# EAGLE design BodyCamBoardV2 (EAGLE 7.3.0)
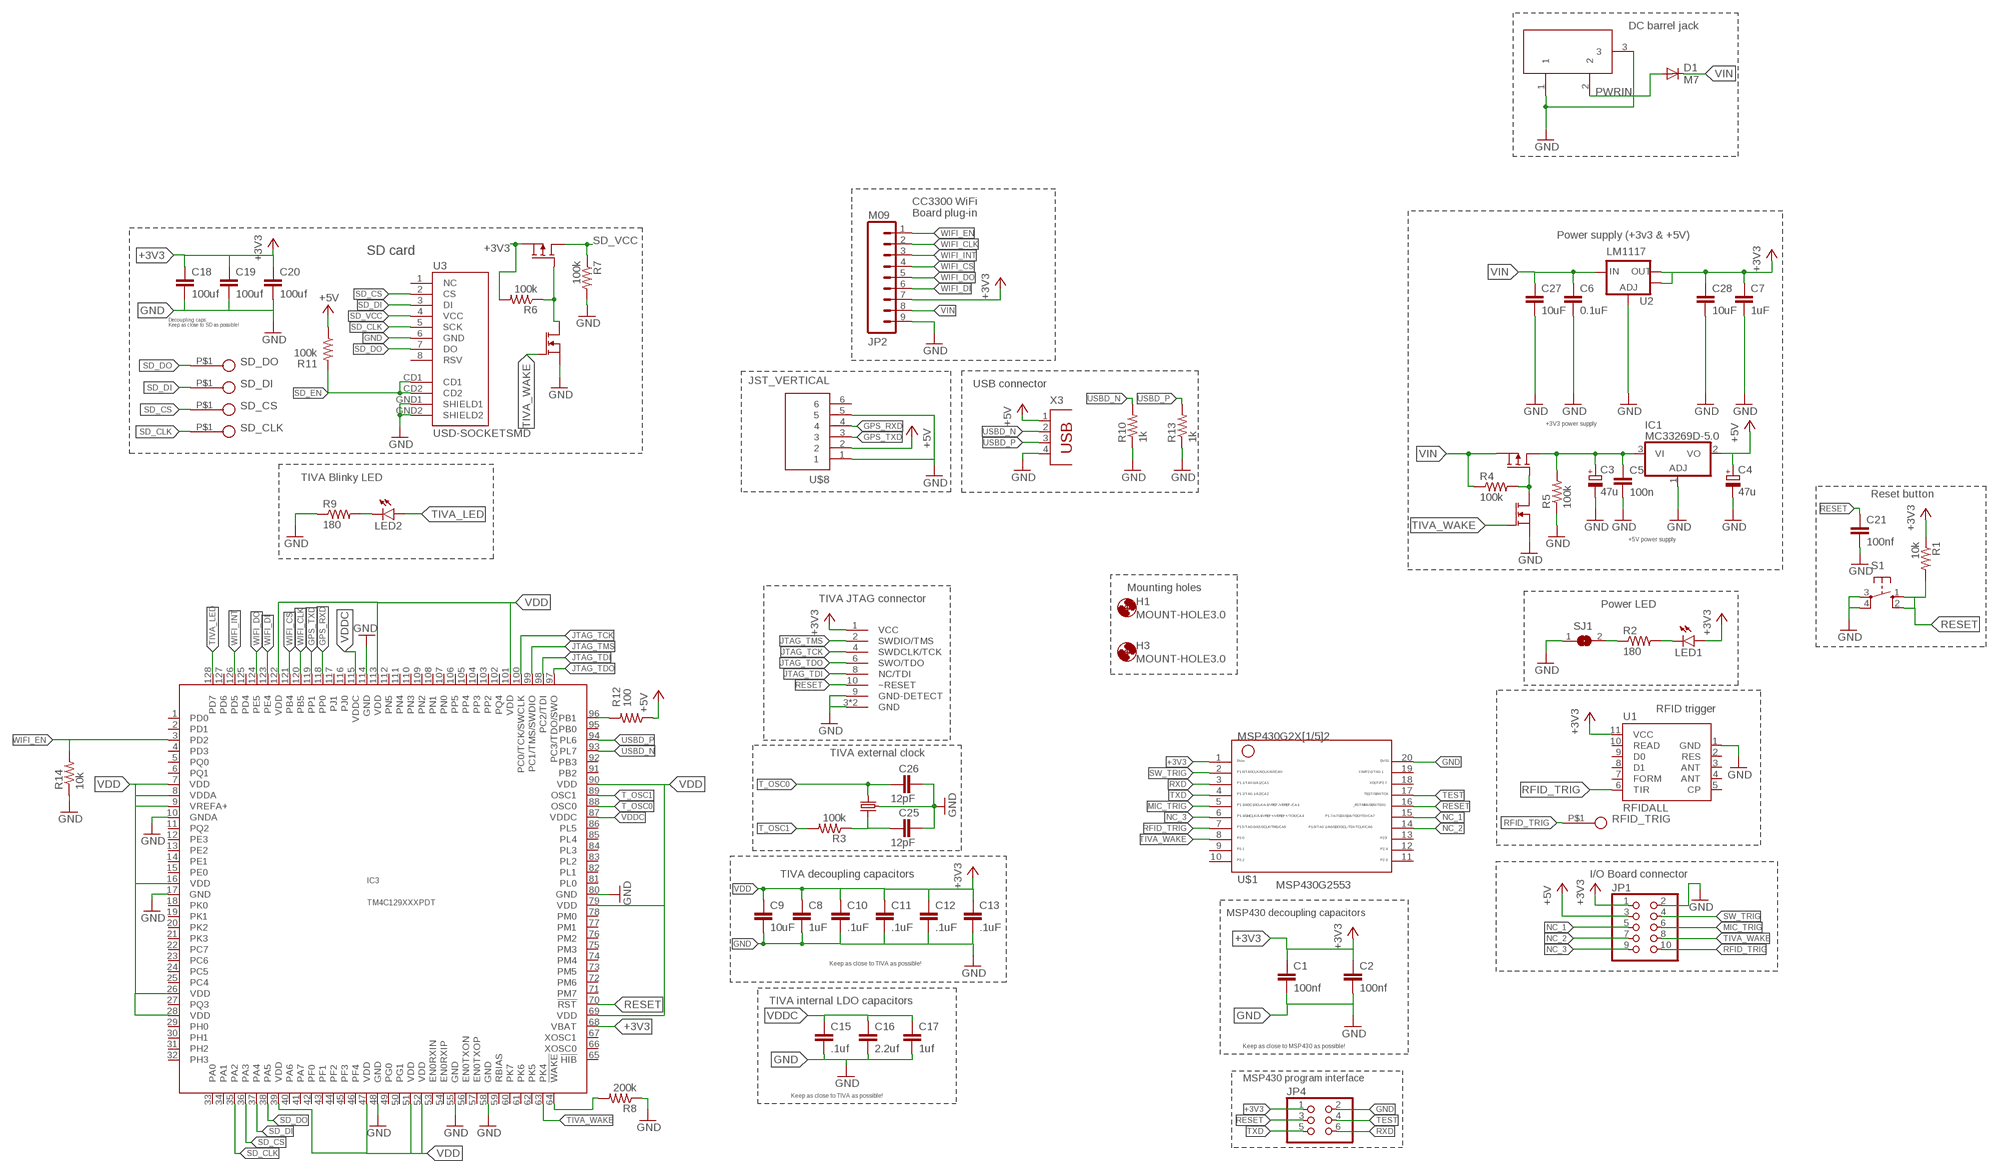
[diagram p0: schematic, sheet 1]

## Parts
C1  100nf  C-EUC0603  [C0603]
C2  100nf  C-EUC0603  [C0603]
C3  47u  CPOL-EUD  [PANASONIC_D]
C4  47u  CPOL-EUD  [PANASONIC_D]
C5  100n  C-EUC0603  [C0603]
C6  0.1uF  CAP0603-CAP  [0603-CAP]
C7  1uF  CAP0603-CAP  [0603-CAP]
C8  1uF  C-EUC0805  [C0805]
C9  10uF  C-EUC0805  [C0805]
C10  .1uF  C-EUC0603  [C0603]
C11  .1uF  C-EUC0603  [C0603]
C12  .1uF  C-EUC0603  [C0603]
C13  .1uF  C-EUC0603  [C0603]
C15  .1uf  C-EUC0805  [C0805]
C16  2.2uf  C-EUC0805  [C0805]
C17  1uf  C-EUC0805  [C0805]
C18  100uf  C-EUC1206  [C1206]
C19  100uf  C-EUC1206  [C1206]
C20  100uf  C-EUC1206  [C1206]
C21  100nf  C-EUC0603  [C0603]
C25  12pF  C-EUC0402  [C0402]
C26  12pF  C-EUC0402  [C0402]
C27  10uF  CAP0603-CAP  [0603-CAP]
C28  10uF  CAP0603-CAP  [0603-CAP]
D1  M7  DIODE-SMB  [SMB]
H1  MOUNT-HOLE3.0  [3,0]
H3  MOUNT-HOLE3.0  [3,0]
IC1  MC33269D-5.0  [DPACK]
IC3  TM4C129XXXPDT  [PDT_S-PQFP-G128]
JP1  PINHD-2X5  [2X05]
JP2  M09  [1X09]
JP4  PINHD-2X3  [2X03]
LED1  LED0603  [LED-0603@1]
LED2  LED0603  [LED-0603@1]
R1  10k  R-US_R0603  [R0603]
R2  180  R-US_R0603  [R0603]
R3  100k  R-US_R0402  [R0402]
R4  100k  R-US_R0603  [R0603]
R5  100k  R-US_R0603  [R0603]
R6  100k  R-US_R0603  [R0603]
R7  100k  R-US_R0603  [R0603]
R8  200k  R-US_R0603  [R0603]
R9  180  R-US_R0603  [R0603]
R10  1k  R-US_R0402  [R0402]
R11  100k  RESISTOR0603  [0603-RES]
R12  100  RESISTOR0603  [0603-RES]
R13  1k  R-US_R0402  [R0402]
R14  10k  R-US_R0603  [R0603]
RFID_TRIG  TEST_POINTSMD_MINI  [TEST_SMD_MINI_5019]
S1  10-XX  [B3F-10XX]
SD_CLK  TEST_POINTSMD_MINI  [TEST_SMD_MINI_5019]
SD_CS  TEST_POINTSMD_MINI  [TEST_SMD_MINI_5019]
SD_DI  TEST_POINTSMD_MINI  [TEST_SMD_MINI_5019]
SD_DO  TEST_POINTSMD_MINI  [TEST_SMD_MINI_5019]
SJ1  SJ  [SJ]
U1  RFIDALL  [ID_PACKAGE]
U2  LM1117  V_REG_LM1117SOT223  [SOT223]
U3  USD-SOCKETSMD  [MICRO-SD-SOCKET-PP]
U$1  G2X[1/5]2---PW20  [PW20]
U$2  STR2P3LLH6  [SOT-23]
U$3  25MHz  CRYSTAL_403C11E16  [4-SMD-SWITCH]
U$4  IRLML2402TRPBF  [SOT-23]
U$5  STR2P3LLH6  [SOT-23]
U$6  IRLML2402TRPBF  [SOT-23]
U$7  2X5_0.05"_CORTEX_DEBUGTH_KEYED_UNSHROUDED  [2X5_0.05"_TH_KEYED_NS]
U$8  JST_VERTICAL  [JST-6-SMD-VERT-1.0MM]
X2  DC21MMX  [DC-21MM]
X3  PN87520  [PN87520]

## Nets
+3V3: C1.1 C2.1 C7.1 C18.1 C19.1 C20.1 C28.1 IC3.68(VBAT) JP1.1 JP2.7 JP4.1 LED1.A R1.1 R6.2 U1.11(VCC) U2.2(OUT) U2.4(OUT) U$1.1 U$5.2(S) U$7.1(VCC)
+5V: C4.+ IC1.2(VO) JP1.3 R11.1 R12.1 U$8.2 X3.1
GND: C1.2 C2.2 C3.- C4.- C5.2 C6.2 C7.2 C8.2 C9.2 C10.2 C11.2 C12.2 C13.2 C15.2 C16.2 C17.2 C18.2 C19.2 C20.2 C21.2 C25.2 C26.2 C27.2 C28.2 IC1.1(ADJ) IC3.10(GNDA) IC3.17(GND) IC3.48(GND) IC3.55(GND) IC3.58(GND) IC3.80(GND) IC3.114(GND) JP1.2 JP2.9 JP4.2 R5.1 R7.2 R8.1 R10.1 R13.1 R14.1 S1.3(P) S1.4(P1) SJ1.1 U1.1(GND) U2.1(ADJ) U3.6(GND) U3.GND1(SHIELD1) U3.GND2(SHIELD2) U$1.20 U$3.2(GND) U$3.4(GND) U$4.2(S) U$6.2(S) U$7.3(GND) U$7.5(GND) U$7.9(GND-DETECT) U$8.1 U$8.5 X2.1 X2.3 X3.4
GPS_RXD: IC3.118(PP0) U$8.4
GPS_TXD: IC3.119(PP1) U$8.3
JTAG_TCK: IC3.100(PC0/TCK/SWCLK) U$7.4(SWDCLK/TCK)
JTAG_TDI: IC3.98(PC2/TDI) U$7.8(NC/TDI)
JTAG_TDO: IC3.97(PC3/TDO/SWO) U$7.6(SWO/TDO)
JTAG_TMS: IC3.99(PC1/TMS/SWDIO) U$7.2(SWDIO/TMS)
MIC_TRIG: JP1.6 U$1.5
N$1: LED1.C R2.2
N$2: R2.1 SJ1.2
N$3: R9.1
N$4: LED2.C R9.2
N$5: R4.2 U$2.1(G) U$4.3(D)
N$8: R3.2
N$9: C3.+ C5.1 IC1.3(VI) R5.2 U$2.3(D)
N$11: R6.1 U$5.1(G) U$6.3(D)
N$56: IC3.96(PB1) R12.2
NC_1: JP1.5 U$1.15
NC_2: JP1.7 U$1.14
NC_3: JP1.9 U$1.6
PWRIN: D1.A X2.2
RESET: C21.1 IC3.70(!RST) JP4.3 R1.2 S1.1(S) S1.2(S1) U$1.16 U$7.10(~RESET)
RFID_TRIG: JP1.10 RFID_TRIG.P$1 U1.6(TIR) U$1.7
RXD: JP4.6 U$1.3
SD_CLK: IC3.35(PA2) SD_CLK.P$1 U3.5(SCK)
SD_CS: IC3.36(PA3) SD_CS.P$1 U3.2(CS)
SD_DI: IC3.37(PA4) SD_DI.P$1 U3.3(DI)
SD_DO: IC3.38(PA5) SD_DO.P$1 U3.7(DO)
SD_EN: R11.2 U3.CD1 U3.CD2
SD_VCC: R7.1 U3.4(VCC) U$5.3(D)
SW_TRIG: JP1.4 U$1.2
T_OSC0: C26.1 IC3.88(OSC0) U$3.3
T_OSC1: C25.1 IC3.89(OSC1) R3.1 U$3.1
TEST: JP4.4 U$1.17
TIVA_LED: IC3.128(PD7) LED2.A
TIVA_WAKE: IC3.63(PK4) JP1.8 U$1.8 U$4.1(G) U$6.1(G)
TXD: JP4.5 U$1.4
USBD_N: IC3.93(PL7) R10.2 X3.2
USBD_P: IC3.94(PL6) R13.2 X3.3
VDD: C8.1 C9.1 C10.1 C11.1 C12.1 C13.1 IC3.7(VDD) IC3.8(VDDA) IC3.9(VREFA+) IC3.16(VDD) IC3.26(VDD) IC3.28(VDD) IC3.39(VDD) IC3.47(VDD) IC3.51(VDD) IC3.52(VDD) IC3.69(VDD) IC3.79(VDD) IC3.90(VDD) IC3.101(VDD) IC3.113(VDD) IC3.122(VDD) ; supply symbol labelled +3V3
VDDC: C15.1 C16.1 C17.1 IC3.87(VDDC) IC3.115(VDDC)
VIN: C6.1 C27.1 D1.C JP2.8 R4.1 U2.3(IN) U$2.2(S)
WAKE_SIG: IC3.64(!WAKE) R8.2
WIFI_CLK: IC3.120(PB5) JP2.2
WIFI_CS: IC3.121(PB4) JP2.4
WIFI_DI: IC3.123(PE4) JP2.6
WIFI_DO: IC3.124(PE5) JP2.5
WIFI_EN: IC3.3(PD2) JP2.1 R14.2
WIFI_INT: IC3.126(PD5) JP2.3
Unconnected: IC3.1(PD0) IC3.2(PD1) IC3.4(PD3) IC3.5(PQ0) IC3.6(PQ1) IC3.11(PQ2) IC3.12(PE3) IC3.13(PE2) IC3.14(PE1) IC3.15(PE0) IC3.18(PK0) IC3.19(PK1) IC3.20(PK2) IC3.21(PK3) IC3.22(PC7) IC3.23(PC6) IC3.24(PC5) IC3.25(PC4) IC3.27(PQ3) IC3.29(PH0) IC3.30(PH1) IC3.31(PH2) IC3.32(PH3) IC3.33(PA0) IC3.34(PA1) IC3.40(PA6) IC3.41(PA7) IC3.42(PF0) IC3.43(PF1) IC3.44(PF2) IC3.45(PF3) IC3.46(PF4) IC3.49(PG0) IC3.50(PG1) IC3.53(EN0RXIN) IC3.54(EN0RXIP) IC3.56(EN0TXON) IC3.57(EN0TXOP) IC3.59(RBIAS) IC3.60(PK7) IC3.61(PK6) IC3.62(PK5) IC3.65(!HIB) IC3.66(XOSC0) IC3.67(XOSC1) IC3.71(PM7) IC3.72(PM6) IC3.73(PM5) IC3.74(PM4) IC3.75(PM3) IC3.76(PM2) IC3.77(PM1) IC3.78(PM0) IC3.81(PL0) IC3.82(PL1) IC3.83(PL2) IC3.84(PL3) IC3.85(PL4) IC3.86(PL5) IC3.91(PB2) IC3.92(PB3) IC3.95(PB0) IC3.102(PQ4) IC3.103(PP2) IC3.104(PP3) IC3.105(PP4) IC3.106(PP5) IC3.107(PN0) IC3.108(PN1) IC3.109(PN2) IC3.110(PN3) IC3.111(PN4) IC3.112(PN5) IC3.116(PJ0) IC3.117(PJ1) IC3.125(PD4) IC3.127(PD6) U1.2(RES) U1.3(ANT) U1.4(ANT) U1.5(CP) U1.7(FORM) U1.8(D1) U1.9(D0) U1.10(READ) U3.1(NC) U3.8(RSV) U$1.9 U$1.10 U$1.11 U$1.12 U$1.13 U$1.18 U$1.19 U$8.6

## Notes on the sheet
- DC barrel jack
- CC3300 WiFi 
  Board plug-in
- Power supply (+3v3 & +5V)
- SD card
- Decoupling caps:
  Keep as close to SD as possible!
- USB connector
- +3V3 power supply
- TIVA Blinky LED
- Reset button
- +5V power supply
- Mounting holes
- TIVA JTAG connector
- Power LED
- RFID trigger
- TIVA external clock
- TIVA decoupling capacitors | I/O Board connector
- MSP430G2553
- MSP430 decoupling capacitors
- Keep as close to TIVA as possible!
- TIVA internal LDO capacitors
- Keep as close to MSP430 as possible!
- MSP430 program interface
- Keep as close to TIVA as possible!

## Library data of the parts
C1 C2 C5 C8-C13 C15-C21 C25 C26 = rcl:C-EU: CAPACITOR, European symbol
C3 C4 = rcl:CPOL-EU: POLARIZED CAPACITOR, European symbol
C6 C7 C27 C28 = SparkFun-Capacitors:CAP: Capacitor Standard 0603 ceramic capacitor, and 0.1" leaded capacitor.
D1 = diode:DIODE-: DIODE
H1 H3 = holes:MOUNT-HOLE: MOUNTING HOLE with drill center marker
IC1 = linear:MC33269?*: Adjustable Output Low Dropout Voltage Regulator 800 mA Source: http://www.onsemi.com/pub/Collateral/MC33269-D.PDF
IC3 = ti-tiva:TM4C129XXX
JP1 = pinhead:PINHD-2X5: PIN HEADER
JP2 = SparkFun-Connectors:M09: Header 9 Standard 9-pin 0.1" header. Use with straight break away headers (SKU : PRT-00116), right angle break away headers (PRT-00553), swiss pins (PRT-00743), machine pins (PRT-00117), and female headers (PRT-00115).
JP4 = pinhead:PINHD-2X3: PIN HEADER
LED1 LED2 = SparkFun-LED:LED: LEDs Standard schematic elements and footprints for 5mm, 3mm, 1206, and 0603 sized LEDs. 5mm - Spark Fun Electronics SKU : COM-00529 (and others)
R1 R2 R4-R9 R14 = resistor:R-US_: RESISTOR, American symbol
R3 R10 R13 = rcl:R-US_: RESISTOR, American symbol
R11 R12 = SparkFun-Resistors:RESISTOR: Resistor Basic schematic elements and footprints for 0603, 1206, and PTH resistors.
RFID_TRIG SD_CLK SD_CS SD_DI SD_DO = MAAV_Standard:TEST_POINT
S1 = switch-omron:10-XX: OMRON SWITCH; MPN: B3F-1000; OC_FARNELL: 176432; OC_NEWARK: 36M3542
SJ1 = jumper:SJ: SMD solder JUMPER
U1 = ID_Innovations:RFID
U2 = SparkFun-PowerIC:V_REG_LM1117: Voltage Regulator LM1117 Standard adjustable voltage regulator but in SMD form. Spark Fun Electronics SKU : COM-00595
U3 = AYYYYYYYYYYY:USD-SOCKET: microSD Socket Push-push type uSD socket. Schematic element and footprint production proven. Spark Fun Electronics SKU : PRT-00127. tDoc lines correctly indicate media card edge positions when inserting (unlocked, locked, depressed).
U$1 = TI_MSP430_v16:G2X[1/5]2---PW20: MSP430G2X[1/5]2 MSP430G2x52, MSP430G2x12 TSSOP (PW) 20 Pin Package http://focus.ti.com/docs/prod/folders/print/msp430g2452.html
U$2 U$5 = MOSFET:STR2P3LLH6
U$3 = imu:CRYSTAL_403C11E16; DIGIKEY: 403C11E16M00000
U$4 U$6 = MOSFET:IRLML2402TRPBF
U$7 = con-cortex:2X5_0.05"_CORTEX_DEBUG
U$8 = SparkFun-Connectors:JST_VERTICAL; PROD_ID: CONN-08249
X2 = powersupply:DC21MM
X3 = con-berg:PN87520: BERG USB connector; OC_FARNELL: unknown; OC_NEWARK: unknown

## Board
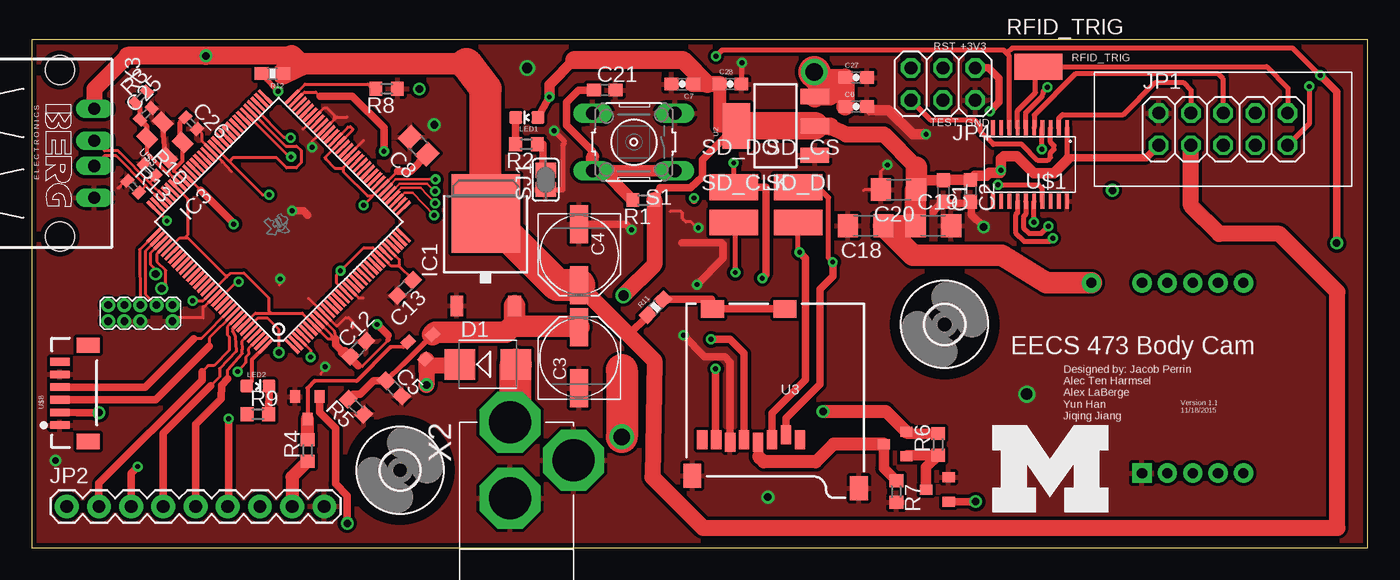
[diagram p1: board, top side]
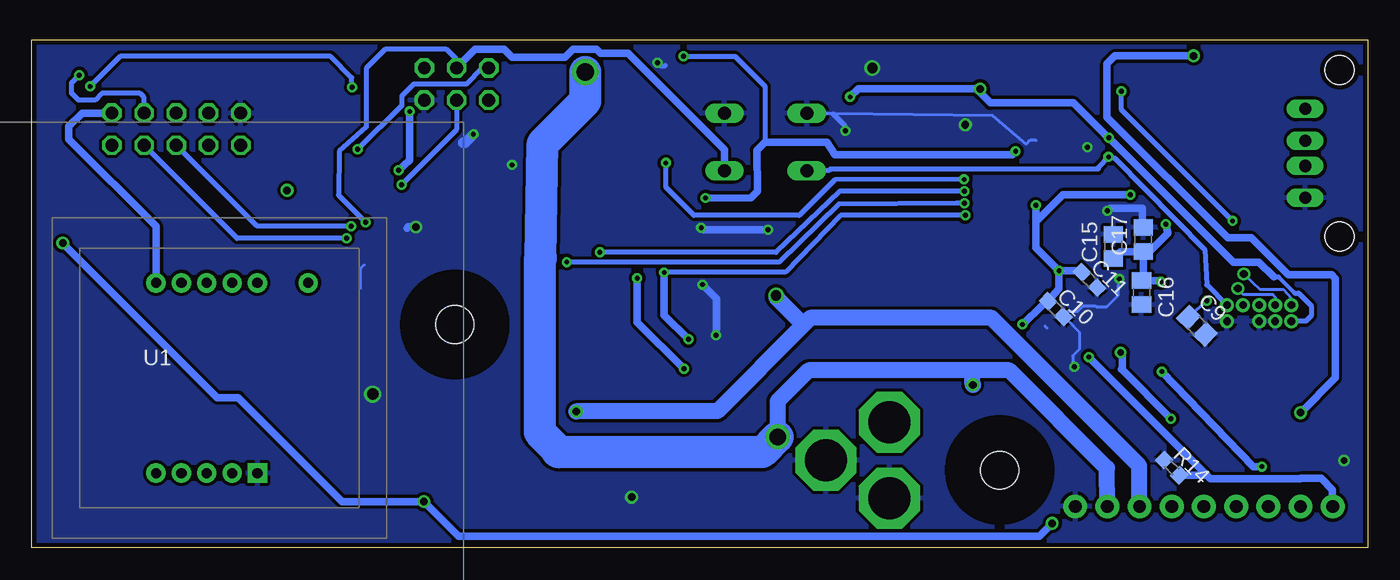
[diagram p2: board, bottom side, seen from below]

Size 105.39 x 40.06 mm. Coordinates in mm from the lower left corner, seen from the top.
Outline: 0,0 105.39,0 105.39,40.06 0,40.06 0,0
Copper layers (1*16): Top 0.035559375mm / dielectric 1.501140625mm / Bottom 0.035559375mm
Design rules "typical_4pcb *": minimum track width 8mil, minimum drill 15mil, track to track 5mil, track to pad 5mil, pad to pad 5mil, via to via 5mil, smd to smd 5mil, copper to edge 15mil, drill to drill 8mil, minimum pad ring 10mil, minimum via ring 8mil, stop-mask expansion 4mil, vias tented up to drill 0mil, thermal gap 10mil

### Footprints (pad centres in the part's own frame; a part is rotated, then mirrored left to right if it is on the bottom)
C0603 = smd 1.1 x 1: 1 -0.85,0; 2 0.85,0
PANASONIC_D = smd 3 x 1.4: + 2.4,0; - -2.4,0
0603-CAP = smd 1.1 x 1: 1 -0.85,0; 2 0.85,0
C0805 = smd 1.3 x 1.5: 1 -0.95,0; 2 0.95,0
C1206 = smd 1.6 x 1.8: 1 -1.4,0; 2 1.4,0
C0402 = smd 0.7 x 0.9: 1 -0.65,0; 2 0.65,0
SMB = smd 2.4 x 2.4: A 2.2,0; C -2.2,0
3,0 = hole 3: 0,0
DPACK = smd 1 x 1.6: 1 -2.28,-4.8; 3 2.28,-4.8 | smd 5.4 x 6.2: 2 0,2.5
PDT_S-PQFP-G128 = smd 0.25 x 1.6: 1 -6.2,-7.65; 2 -5.8,-7.65; 3 -5.4,-7.65; 4 -5,-7.65; 5 -4.6,-7.65; 6 -4.2,-7.65; 7 -3.8,-7.65; 8 -3.4,-7.65; 9 -3,-7.65; 10 -2.6,-7.65; 11 -2.2,-7.65; 12 -1.8,-7.65; 13 -1.4,-7.65; 14 -1,-7.65; 15 -0.6,-7.65; 16 -0.2,-7.65; 17 0.2,-7.65; 18 0.6,-7.65; 19 1,-7.65; 20 1.4,-7.65; 21 1.8,-7.65; 22 2.2,-7.65; 23 2.6,-7.65; 24 3,-7.65; 25 3.4,-7.65; 26 3.8,-7.65; 27 4.2,-7.65; 28 4.6,-7.65; 29 5,-7.65; 30 5.4,-7.65; 31 5.8,-7.65; 32 6.2,-7.65; 65 6.2,7.65; 66 5.8,7.65; 67 5.4,7.65; 68 5,7.65; 69 4.6,7.65; 70 4.2,7.65; 71 3.8,7.65; 72 3.4,7.65; 73 3,7.65; 74 2.6,7.65; 75 2.2,7.65; 76 1.8,7.65; 77 1.4,7.65; 78 1,7.65; 79 0.6,7.65; 80 0.2,7.65; 81 -0.2,7.65; 82 -0.6,7.65; 83 -1,7.65; 84 -1.4,7.65; 85 -1.8,7.65; 86 -2.2,7.65; 87 -2.6,7.65; 88 -3,7.65; 89 -3.4,7.65; 90 -3.8,7.65; 91 -4.2,7.65; 92 -4.6,7.65; 93 -5,7.65; 94 -5.4,7.65; 95 -5.8,7.65; 96 -6.2,7.65 | smd 1.6 x 0.25: 33 7.65,-6.2; 34 7.65,-5.8; 35 7.65,-5.4; 36 7.65,-5; 37 7.65,-4.6; 38 7.65,-4.2; 39 7.65,-3.8; 40 7.65,-3.4; 41 7.65,-3; 42 7.65,-2.6; 43 7.65,-2.2; 44 7.65,-1.8; 45 7.65,-1.4; 46 7.65,-1; 47 7.65,-0.6; 48 7.65,-0.2; 49 7.65,0.2; 50 7.65,0.6; 51 7.65,1; 52 7.65,1.4; 53 7.65,1.8; 54 7.65,2.2; 55 7.65,2.6; 56 7.65,3; 57 7.65,3.4; 58 7.65,3.8; 59 7.65,4.2; 60 7.65,4.6; 61 7.65,5; 62 7.65,5.4; 63 7.65,5.8; 64 7.65,6.2; 97 -7.65,6.2; 98 -7.65,5.8; 99 -7.65,5.4; 100 -7.65,5; 101 -7.65,4.6; 102 -7.65,4.2; 103 -7.65,3.8; 104 -7.65,3.4; 105 -7.65,3; 106 -7.65,2.6; 107 -7.65,2.2; 108 -7.65,1.8; 109 -7.65,1.4; 110 -7.65,1; 111 -7.65,0.6; 112 -7.65,0.2; 113 -7.65,-0.2; 114 -7.65,-0.6; 115 -7.65,-1; 116 -7.65,-1.4; 117 -7.65,-1.8; 118 -7.65,-2.2; 119 -7.65,-2.6; 120 -7.65,-3; 121 -7.65,-3.4; 122 -7.65,-3.8; 123 -7.65,-4.2; 124 -7.65,-4.6; 125 -7.65,-5; 126 -7.65,-5.4; 127 -7.65,-5.8; 128 -7.65,-6.2
2X05 = drill 1.016 octagon: 1 -5.08,-1.27; 2 -5.08,1.27; 3 -2.54,-1.27; 4 -2.54,1.27; 5 0,-1.27; 6 0,1.27; 7 2.54,-1.27; 8 2.54,1.27; 9 5.08,-1.27; 10 5.08,1.27
1X09 = drill 1.016 pad 1.88: 1 0,0; 2 2.54,0; 3 5.08,0; 4 7.62,0; 5 10.16,0; 6 12.7,0; 7 15.24,0; 8 17.78,0; 9 20.32,0
2X03 = drill 1.016 octagon: 1 -2.54,-1.27; 2 -2.54,1.27; 3 0,-1.27; 4 0,1.27; 5 2.54,-1.27; 6 2.54,1.27
LED-0603@1 = smd 1 x 1: A 0,-0.877; C 0,0.877
R0603 = smd 1 x 1.1: 1 -0.85,0; 2 0.85,0
R0402 = smd 0.7 x 0.9: 1 -0.65,0; 2 0.65,0
0603-RES = smd 1.1 x 1: 1 -0.85,0; 2 0.85,0
TEST_SMD_MINI_5019 = smd 3.81 x 2.032: P$1 0,0
B3F-10XX = drill 1.016 long: 1 -3.251,2.261; 2 3.251,2.261; 3 -3.251,-2.261; 4 3.251,-2.261
SJ = smd 1.168 x 1.6: 1 -0.762,0; 2 0.762,0
ID_PACKAGE = drill 0.8 pad 1.524 square: 1 3,-7.5 | drill 0.8 pad 1.524: 2 1,-7.5; 3 -1,-7.5; 4 -3,-7.5; 5 -5,-7.5; 6 -5,7.5; 7 -3,7.5; 8 -1,7.5; 9 1,7.5; 10 3,7.5; 11 7,7.5
SOT223 = smd 1.219 x 2.235: 1 -2.311,-3.099; 2 0,-3.099; 3 2.311,-3.099 | smd 3.6 x 2.2: 4 0,3.099
MICRO-SD-SOCKET-PP = smd 0.8 x 1.5: 1 -8.94,10.7; 2 -7.84,10.3; 3 -6.74,10.7; 4 -5.64,10.9; 5 -4.54,10.7; 6 -3.44,10.9; 7 -2.34,10.7; 8 -1.24,10.7 | smd 1.8 x 1.4: CD1 -7.75,0.4; CD2 -2.05,0.4 | smd 1.4 x 1.9: GND1 -13.6,14.55; GND2 -0.45,13.55
PW20 = smd 0.3 x 1.2: 1 -2.925,-2.9; 2 -2.275,-2.9; 3 -1.625,-2.9; 4 -0.975,-2.9; 5 -0.325,-2.9; 6 0.325,-2.9; 7 0.975,-2.9; 8 1.625,-2.9; 9 2.275,-2.9; 10 2.925,-2.9; 11 2.925,2.9; 12 2.275,2.9; 13 1.625,2.9; 14 0.975,2.9; 15 0.325,2.9; 16 -0.325,2.9; 17 -0.975,2.9; 18 -1.625,2.9; 19 -2.275,2.9; 20 -2.925,2.9
SOT-23 = smd 0.965 x 0.787: 1 -0.886,0.953; 2 -0.886,-0.953; 3 0.886,0
4-SMD-SWITCH = smd 1.372 x 1.067: 1 -1.118,-0.864; 2 1.118,-0.864; 3 1.118,0.864; 4 -1.118,0.864
2X5_0.05"_TH_KEYED_NS = drill 0.6 pad 0.95: 1 -2.54,-0.635; 2 -2.54,0.635; 3 -1.27,-0.635; 4 -1.27,0.635; 5 0,-0.635; 6 0,0.635; 8 1.27,0.635; 9 2.54,-0.635; 10 2.54,0.635
JST-6-SMD-VERT-1.0MM = smd 0.6 x 1.55: 1 -2.54,1.27; 2 -1.54,1.27; 3 -0.54,1.27; 4 0.46,1.27; 5 1.46,1.27; 6 2.46,1.27 | smd 1.2 x 1.8: P$1 -3.84,-0.955; P$2 3.76,-0.955
DC-21MM = drill 3.302 pad 4.826 octagon: 1 -5.08,-3.353; 2 -0.076,-6.35; 3 -0.076,-0.356
PN87520 = drill 0.95 long: 1 -3.5,2.71; 2 -1,2.71; 3 1,2.71; 4 3.5,2.71 | hole 2.3: -6.57,0; 6.57,0

### Placement (x,y rotation side)
C1  71.91,28.13 270 top
C2  74.04,28.16 270 top
C3  43.18,14.99 90 top
C4  43.18,23.11 270 top
C5  28.57,12.58 315 top
C6  65.02,34.8 0 top
C7  51.31,36.58 180 top
C8  30.52,31.71 135 top
C9  13.47,17.52 315 bottom
C10  24.62,18.84 315 bottom
C11  21.95,21.13 315 bottom
C12  25.76,15.7 45 top
C13  29.44,20.5 225 top
C15  20.07,23.78 90 bottom
C16  17.84,20.13 270 bottom
C17  17.72,24.32 90 bottom
C18  65.79,25.4 180 top
C19  71.12,25.4 0 top
C20  68.39,28.26 180 top
C21  45.21,36.1 0 top
C25  9.01,34.23 45 top
C26  12.57,33.5 315 top
C27  65.02,37.08 0 top
C28  55.12,36.58 0 top
D1  35.97,14.48 0 top
H1  29.05,6.13 0 top
H3  72.01,17.62 0 top
IC1  35.81,23.88 0 top
IC3  19.48,25.73 45 top
JP1  93.98,33.02 0 top
JP2  2.76,3.27 0 top
JP4  71.88,36.58 180 top
LED1  39.05,33.94 90 top
LED2  17.84,12.76 270 top
R1  48.26,27.43 180 top
R2  39.02,31.85 180 top
R3  8.62,35.55 45 top
R4  21.78,7.68 90 top
R5  25.57,11.13 135 top
R6  71.5,8.16 90 top
R7  68.2,4.45 270 top
R8  28,36.2 180 top
R9  17.84,10.54 0 top
R10  9.3,29.82 315 top
R11  49.2,18.99 45 top
R12  18.99,37.4 180 top
R13  8,28.49 315 top
R14  15.47,6.33 315 bottom
RFID_TRIG  79.41,37.94 0 top
S1  47.5,32 180 top
SD_CLK  55.37,25.65 0 top
SD_CS  60.45,28.45 0 top
SD_DI  60.45,25.65 0 top
SD_DO  55.37,28.45 0 top
SJ1  40.54,29.02 90 top
U1  90.58,13.4 0 bottom
U2  58.67,33.27 90 top
U3  51.66,19.24 180 top
U$1  78.74,30.23 180 top
U$2  30.99,16.19 45 top
U$3  10.51,32.16 315 top
U$4  21.75,11.05 270 top
U$5  68.1,8.19 180 top
U$6  71.44,4.6 180 top
U$7  8.57,18.51 0 top
U$8  3.49,12.22 90 top
U$9  [BLOCK-M-10MM]  80.33,6.13 0 top
X2  37.66,3.56 180 top
X3  2.22,31.11 270 top

### Tracks (layer width: path | path; a pad name or v marks a point on that pad's centre or on a via)
+3V3  (via drill 0.38, 0.6, 0.8)
  Top 0.254: IC3.68 19.93,32.35 v20.41,32.35
  Top 0.406: U$1.1 81.66,30.77 81.66,30.57
  Top 0.61: v40.83,35.56 40.82,35.55 LED1.A | R1.1 49.56,28.38 51.98,28.42 52.9,29.27 52.9,30.59 U2.4 | 81.66,30.77 87.92,30.77 JP1.1 | JP4.1 75.47,37.85 76.3,37.02 76.3,35.15 v75.56,34.42
  Top 0.813: 81.66,30.57 80.64,29.56 79.06,29.56 77.72,30.9 76.68,30.9 76.45,30.68 v76.45,29.78 76.42,29.59 75.53,29.59 75.3,29.35 74.38,29.35 C2.1 71.94,29.01 C1.1 70.51,28.98 C20.1 | 42.8,38.48 40.83,36.51 v40.83,35.56 | R6.2 69.12,9.01 U$5.2
  Top 1.016: C28.1 54.26,33.27 U2.4 | v62.42,10.76 67.37,10.76 U$5.2
  Top 1.27: 69.79,30.04 67.22,32.6 64.26,32.6 62.98,33.24 | C28.1 53.28,36.58 C7.1 | R1.1 49.11,22.34 v46.67,19.91
  Top 1.422: U2.2 62.98,33.24 | 42.8,38.48 51.37,38.48 53.28,36.58
  Top 1.676: 69.79,30.04 C20.1 69.72,28.19 C19.1 C18.1 69.5,23.08 76.52,23.08 80.04,20.89 U1.11 83.37,20.9
  Top 2.184: U2.4 U2.2
  Bottom 0.254: 30.57,35.88 v30.57,36.2
  Bottom 0.305: 7.05,21.37 5.78,20.1
  Bottom 0.406: 7.43,21.37 7.05,21.37 | 5.78,20.1 5.46,20.1 4.48,19.11 4.48,18.29 4.89,17.88 U$7.1
  Bottom 0.61: v75.56,34.42 75.56,30.57 v76.45,29.78 | v40.83,35.56 40.2,36.2 v30.57,36.2 | 30.57,35.88 29.78,35.08 23.21,35.08 20.45,32.35 v20.41,32.35 10.6,22.54 8.6,22.54 7.43,21.37
  Bottom 1.27: JP2.7 18.03,6.48 29.69,18.13 43.97,18.13 44.5,17.61 | 44.5,17.61 51.31,10.79 v62.42,10.76 | v46.67,19.91 46.67,19.78 44.5,17.61
+5V  (via drill 0.6)
  Top 0.61: U$8.2 3.6,10.67 v5.3,10.67 | R11.1 48.6,18.31 47.09,16.8
  Top 1.27: C4.+ 43.18,20.92 43.02,21.17 43.4,20.48 47.09,16.8 49.12,14.76 48.96,5.59 52.96,1.59 103,1.59 103,20.19 98.42,24.77 93.66,24.77 91.44,26.99 JP1.3 | 7.56,38.8 4.93,36.17 X3.1
  Top 1.422: 20.51,38.8 v13.75,38.8 7.56,38.8
  Top 1.676: 34.29,38.16 21.49,38.16 R12.1 20.85,38.46 20.51,38.8
  Top 2.54: C4.+ 41.48,20.71 IC1.2 35.81,36.2 34.29,38.16
  Bottom 0.61: v5.3,10.67 2.57,13.4 2.57,21.24 2.86,21.53 6.25,21.53 9.18,24.45 11.05,24.45 20.57,33.97 20.57,38.16 19.93,38.8 v13.75,38.8
GND  (via drill 0.38, 0.5, 0.6, 0.8, 0.9)
  Top 0.254: IC3.10 24.01,17.53 24.13,17.53 24.77,18.16 24.99,18.16 25.3,17.84 25.3,17.34 | IC3.10 23.62,17.91 | IC3.10 21.88,19.65 21.84,19.65 | 14.99,30.51 15.02,30.42 | 14.99,30.51 15.75,29.69 | 21.4,33.02 IC3.58 23.08,34.7 23.27,34.7 23.84,34.13 23.84,33.77 IC3.55 23.04,32.94 23.01,32.94 22.42,32.35 | IC3.48 26.16,32.13 | 22.13,32.07 22.1,32.04 v22.13,31.59 22.13,32.07 | 65.63,28.19 65.69,28.26 C20.2 66.99,29.68 v67.5,30.19 | IC3.114 13.62,19.02 13.49,19.02 13.49,18.19 13.56,18.13 11.37,18.13 U$7.9 | v23.15,14.29 23.15,14.06 22.8,13.72 | v19.59,21.21 19.56,20.73 | 22.13,32.07 22.42,32.35 | 22.42,32.35 22.45,32.35 24.07,33.97 24.86,33.97 | IC3.17 25.78,19.72 26.16,19.72 | v52.58,25.24 52.48,25.24 52.01,25.72 51.59,25.72 51.34,25.97 51.34,26.42 51.21,26.54 50.36,26.54 | 14.99,30.51 14.98,30.51 IC3.80 13.43,32.07 13.43,32.64 C26.2 | 7.45,29.01 6.99,28.54 6.99,28.45 6.92,28.38 6.79,28.38
  Top 0.406: 56.01,38.23 56.01,36.62 C28.2 56.04,36.65 v56.04,38.26 | SJ1.1 41.88,28.26 41.91,28.23 41.91,31.78 42.01,31.88 42.01,32.1 v41.21,32.89 | U$3.2 10.55,31.12 U$3.4
  Top 0.61: C1.2 71.83,27.28 71.22,26.67 71.22,26.61 71.09,26.48 71.09,26.51 71.75,27.18 74.01,27.18 74.11,27.27 74.11,26.29 v75.09,25.3 | C4.- 46.88,25.51 v47.31,25.08 | 51.31,24.07 54.42,24.07 54.55,23.94 54.55,22.83 v52.48,20.77 | U3.6 55.1,14.66 54.67,15.08 53.09,15.08 v51.4,16.76 | v20.54,26.57 21.43,26.57 21.78,26.23
  Top 0.813: C6.2 66.16,34.51 67.6,34.51 69.5,32.61 v70.55,32.61
  Bottom 0.254: 26.16,32.13 26.64,32.13 26.92,31.84 29.59,34.07 42.2,34.23 44.23,34.23 | 79.44,20.48 79.44,22.04 79.15,22.32 | v67.5,30.19 67.5,30.39 67.47,30.42 | C10.2 23.88,18.17 | 23.88,18.17 23.24,17.53 23.24,17.49 22.77,17.02 22.77,15.65 23.27,15.14 23.27,14.41 v23.15,14.29 | 23.88,18.17 23.88,18.41 23.62,18.67 22.86,18.67 22.45,19.08 21.5,19.08 21.43,19.02 20.57,19.02 19.68,19.91 19.68,20.57 v19.59,21.21 | v22.13,31.59 22.04,31.88 | 25.3,17.34 25.46,17.49
  Bottom 0.406: v56.04,38.26 55.82,38.04 55.4,38.04 | v41.21,32.89 41.21,33.24 42.2,34.23
  Bottom 0.61: v75.09,25.3 75.69,25.3 75.79,25.21 | v47.31,25.08 52.42,25.08 v52.58,25.24 | v52.48,20.77 51.37,19.65 51.37,17.49 v51.4,16.76 | C17.2 17.78,25.33 17.78,26.8 20.32,26.8 v20.54,26.57
  Bottom 0.813: v70.55,32.61 71.22,31.94 71.37,31.94
  other vias: 78.49,12.13 58.07,4 31.75,33.37 39.08,37.85 1.87,6.89
  pour Bottom (isolate 0.254): -4.06,104.65 -4.06,-4.83 164.34,-4.83 164.34,104.65
  pour Top (isolate 0.254): -7.87,-8.13 10.16,-8.38 169.16,-8.38 169.16,109.98 -7.62,109.98 -7.62,4.83
GPS_RXD
  Top 0.254: IC3.118 13.38,16.51 12.79,16.51
  Top 0.61: 12.79,16.51 8.97,12.68 U$8.4
GPS_TXD
  Top 0.254: IC3.119 14,16.57 14,15.91
  Top 0.61: 14,15.91 9.78,11.68 U$8.3
JTAG_TCK  (via drill 0.6)
  Top 0.254: IC3.100 9.87,23.19 9.87,22.57 10.57,21.88 10.57,20.77 v10.26,20.45
  Bottom 0.254: U$7.4 7.3,19.78 7.49,19.97 9.81,19.97 10.26,20.41 v10.26,20.45
JTAG_TDI
  Top 0.254: IC3.98 8.95,23.4 8.95,20 9.81,19.14 U$7.8
JTAG_TDO
  Top 0.254: IC3.97 8.51,23.52 U$7.6
JTAG_TMS  (via drill 0.6)
  Top 0.254: IC3.99 9.37,23.25 9.37,22.35 9.78,21.94 v9.78,21.59
  Bottom 0.254: v9.78,21.59 8.51,20.38 6.67,20.38 6.03,19.68 U$7.2
MIC_TRIG
  Top 0.406: JP1.6 93.98,36.99 93.6,37.37 82.33,37.37 79.09,34.13 79.09,33.15 U$1.5
N$1
  Top 0.61: LED1.C R2.2
N$2
  Top 0.61: R2.1 40.35,31.82 40.35,29.97 SJ1.2
N$4
  Top 0.61: LED2.C R9.2
N$5
  Top 0.305: U$2.1 29.3,15.84 28.29,15.81 25.62,13.14 22.32,13.18 21.75,12.61 U$4.3
  Top 1.016: R4.2 21.75,8.56 U$4.3
N$9
  Top 0.406: U$2.3 29.25,14.45 C5.1
  Top 0.61: C5.1 26.96,13.18 25.91,12.13 25.37,12.13 R5.2
  Top 1.676: U$2.3 31.82,17.02 37.43,17.02 37.89,17.48 | 37.89,17.48 38.09,17.68 IC1.3 | C3.+ 43.09,17.48 37.89,17.48
N$11
  Top 0.813: U$6.3 70.55,6.36 R6.1 69.06,7.31 U$5.1
N$14  (via drill 0.6)
  other vias: 85.25,28.19
N$56  (via drill 0.38)
  Top 0.254: IC3.96 v10.67,25.78
  Top 0.406: v19.43,36.01 19.15,36.28 R12.2
  Bottom 0.406: v10.67,25.78 19.43,34.54 v19.43,36.01
NC_1  (via drill 0.38)
  Top 0.406: U$1.15 78.42,26.31 78.23,26.13 78.23,25.24 78.68,24.8 79.63,24.8 v80.2,25.37
  Bottom 0.406: v80.2,25.37 87.6,25.37 JP1.5
NC_2  (via drill 0.38)
  Top 0.406: U$1.14 77.77,26.43 77.6,26.26 77.6,24.86 78.3,24.16 80.3,24.16 v80.55,24.42
  Bottom 0.406: v80.55,24.42 89.19,24.42 JP1.7
NC_3  (via drill 0.38)
  Top 0.406: v100.78,36.39 100.78,33.47 JP1.9 | U$1.6 78.42,34.31 79.69,35.59 79.79,35.91 79.79,36.01 v80.11,36.32
  Bottom 0.406: v100.78,36.39 98.39,38.77 81.82,38.77 80.14,37.08 v80.11,36.32
PWRIN
  Top 2.54: X2.2 38.17,10.35 D1.A
RESET  (via drill 0.38)
  Top 0.254: IC3.70 20.32,30.83
  Top 0.406: v79.06,25.69 79.06,27.32 U$1.16 | 20.32,30.83 v20.45,30.83
  Top 0.61: 44.25,30.88 44.25,31.29 42.2,33.34 42.2,35.15 43.15,36.1 C21.1
  Top 0.889: S1.1 S1.2 45.1,29.74 R1.2
  Top 1.016: S1.2 44.25,30.88
  Bottom 0.254: 21.27,29.88 20.35,30.8 20.38,30.83
  Bottom 0.406: JP4.3 71.88,38.51 72.68,39.31 77.5,39.31 78.99,37.81 78.99,33.18 81.12,31.27 81.19,27.81 v79.06,25.69 | S1.2 42.52,29.74 42.39,29.88 21.27,29.88 21.27,30 v20.45,30.83 | 20.38,30.83 19.97,30.73 12.86,23.53 12.7,20.73 U$7.10
  Bottom 0.61: S1.1 50.75,31.38 58.36,38.99 60.52,38.99 60.83,39.31 62.67,39.31 63.31,38.67 67.5,38.67 68.14,39.31 70.42,39.31 JP4.3
RFID_TRIG
  Top 0.406: U$1.7 77.77,34.49 79.18,35.91 79.18,37.72 RFID_TRIG.P$1 97.41,37.94 99.09,36.26 99.09,34.32 JP1.10
  Bottom 0.61: JP1.10 101.41,34.29 102.46,33.24 102.46,32.23 95.58,25.35 U1.6
RXD
  Top 0.406: JP4.6 70.93,33.72 74.42,33.72 74.83,33.31 74.83,32.83 75.85,31.81 78.11,31.81 79.38,30.54 80.11,30.54 80.36,30.8 80.36,31.15 80.64,31.43 80.64,31.72 80.36,32 U$1.3
SD_CLK  (via drill 0.38)
  Top 0.203: IC3.35 29.4,28 30.04,28 v31.75,26.23
  Top 0.406: v55.5,21.72 55.5,25.53 SD_CLK.P$1
  Top 0.61: v53.59,16.45 55.09,16.45 56.2,15.34 U3.5
  Bottom 0.406: v31.75,26.23 41.59,26.23 45.94,21.75 55.47,21.75 v55.5,21.72 55.44,21.84
  Bottom 0.61: v55.5,21.72 55.5,18.35 v53.59,16.45
SD_CS  (via drill 0.38)
  Top 0.203: IC3.36 29.15,28.38 30.67,28.38 v31.81,27.18
  Top 0.406: v63.18,22.54 62.87,22.86 62.87,27.62 62.23,28.26 60.64,28.26 SD_CS.P$1
  Top 0.61: U3.2 59.5,10.22 62.17,12.89 62.17,20.41 63.18,21.43 v63.18,22.54
  Bottom 0.406: v31.81,27.18 32.45,27.18 41.72,27.11 46.42,22.54 v63.18,22.54
SD_DI  (via drill 0.38)
  Top 0.203: IC3.37 29.02,28.73 31.18,28.73 v31.81,28.13
  Top 0.406: v60.58,23.3 60.45,23.43 SD_DI.P$1
  Top 0.61: U3.3 58.39,8.55 58.39,10.64 61.02,13.27 61.02,22.86 v60.58,23.3
  Bottom 0.406: v31.81,28.13 41.62,28.13 46.67,23.3 v60.58,23.3
SD_DO  (via drill 0.38)
  Top 0.203: IC3.38 28.7,29.08 31.81,29.08 v31.84,29.05
  Top 0.406: v55.37,30.35 SD_DO.P$1
  Top 0.61: SD_DO.P$1 57.91,28.45 57.91,21.56 v57.63,21.27 | v53.94,14.13 53.94,9.31 U3.7
  Bottom 0.406: v31.84,29.05 42.04,29.02 44.83,26.23 53.15,26.23 SD_DO.P$1 v55.37,30.35
  Bottom 0.61: v57.63,21.27 57.63,17.81 v53.94,14.13
SD_EN
  Top 0.61: R11.2 53.63,19.59 U3.CD2 U3.CD1
SD_VCC
  Top 0.61: 57.34,7.21 57.34,8.3 U3.4
  Top 0.813: U$5.3 67.22,6.28 R7.1
  Top 1.016: U$5.3 63.25,8.19 61.85,6.79 57.75,6.79 57.34,7.21
SW_TRIG
  Top 0.406: U$1.2 81.02,33.87 81.31,34.16 86.11,34.16 88.65,36.7 90.84,36.7 91.44,36.1 JP1.4
T_OSC0
  Top 0.254: IC3.88 11.24,29.73
  Top 0.305: 11.24,29.73 11.24,29.84 11.91,30.51 U$3.3
  Top 0.406: U$3.3 11.72,32.17 11.72,33.56 C26.1
T_OSC1
  Top 0.254: IC3.89 11.65,28.73 10.83,29.56
  Top 0.305: 10.83,29.56 10.67,29.56 9.11,31.12 U$3.1
  Top 0.406: U$3.1 9.11,33.21 C25.1 8.55,34.71 R3.1
TEST  (via drill 0.38)
  Top 0.406: v76.2,28.64 79.41,28.64 79.69,28.38 79.69,27.35 U$1.17
  Bottom 0.406: JP4.4 71.88,32.99 v76.2,28.64
TIVA_LED
  Top 0.254: 18.46,15.92 IC3.128
  Top 0.305: 18.46,15.92 17.37,14.83 17.37,13.16 LED2.A
TIVA_WAKE  (via drill 0.38, 0.6)
  Top 0.203: IC3.63
  Top 0.254: 22.73,35.62 22.42,35.94 21.5,35.94 IC3.63
  Top 0.406: U$1.8 77.11,38.8 76.88,39.04 | 76.88,39.04 76.68,39.24 54.45,39.24 v53.98,38.77 | v101.63,37.27 101.6,37.27 99.47,39.4 77.34,39.4 76.98,39.04 76.88,39.04
  Top 0.61: v52.23,27.59 52.26,27.43 | 22.73,35.62 25.27,35.62 27.78,33.12 v27.78,31.27 | U$4.1 22.7,10.7 23.97,9.43 23.97,5.05 24.89,4.13 v24.89,1.94 | v102.93,24.04 102.93,35.97 v101.63,37.27 | v74.45,3.65 U$6.1
  Bottom 0.406: v53.98,38.77 49.91,38.77 47.56,36.42 47.56,32 | JP1.8 96.52,35.53 96.84,35.85 99.85,35.85 100.39,35.31 101.69,35.31 102.23,35.85 102.23,36.67 v101.63,37.27
  Bottom 0.61: v27.78,31.27 28.04,31.02 42.04,31.02 42.67,32 47.56,32 48.2,31.37 48.13,28.12 48.64,27.61 v52.23,27.59 | v24.89,1.94 25.91,0.92 71.72,0.92 v74.45,3.65 80.9,3.65 89.09,11.84 90.74,11.84 v102.93,24.04
TXD  (via drill 0.38)
  Top 0.406: v79.69,31.43 79.69,33.1 U$1.4
  Bottom 0.406: JP4.5 69.85,37.85 71.12,36.58 75.25,36.58 76.2,35.62 76.2,34.86 v79.69,31.43
USBD_N
  Top 0.254: IC3.93 10.51,27.6 9.31,28.8 | 9.31,28.8 6.93,31.19 6.93,31.2 6.83,31.3 5.74,31.3 X3.2 | R10.2 9.76,29.26 9.31,28.8
USBD_P
  Top 0.254: IC3.94 9.01,28.57 | 9.01,28.57 6.66,30.92 5.73,30.92 X3.3 | R13.2 8.54,28.09 9.01,28.57
VDD  (via drill 0.38)
  Top 0.254: 18.29,33.43 IC3.69 20.03,31.69 20.89,31.69 21.24,31.34 21.24,30.35 20.86,29.97 20.1,29.97 19.3,30.77 15.91,30.77 15.6,30.46 | IC3.9 23.86,17.11 23.96,16.58 | 23.96,16.58 23.97,16.51 | IC3.28 28.99,22.73 28.99,22.23 | 28.99,22.23 28.35,22.23 27.61,22.97 IC3.26 26.9,23.69 26.19,23.69 v24.35,21.84 24.07,21.56 24.07,20.86 IC3.16 | 23.65,16.51 23.34,16.51 IC3.7 21.34,18.51 18.89,18.51 | 23.65,16.51 23.89,16.51 23.96,16.58 | 23.87,32.13 IC3.52 24.96,33.18 25.15,33.21 25.34,33.02 25.27,32.9 IC3.51 24.15,31.81 23.15,30.8 23.18,30.67 23.91,29.94 24.54,29.94 IC3.47 | IC3.47 | IC3.113 | IC3.8 23.65,16.75 23.65,16.51 | IC3.122 17.64,18.51 18.89,18.51 | IC3.47 24.57,29.97 24.57,29.65 26.48,27.75 26.88,27.75 IC3.39 | IC3.39 27.56,28.45 v26.19,27.02 | IC3.113 14.18,20.15 15.4,21.37 | 15.4,21.37 15.68,21.65 16.73,21.68 18.7,19.72 18.7,18.7 18.89,18.51 | IC3.101 10.82,23.59 11.68,24.45 12.06,24.45 | 12.06,24.45 12.32,24.45 15.4,21.37 | IC3.90 12.32,27.53 12.32,24.7 12.06,24.45 | 25.09,15.01 C12.1 | 25.75,14.35 26.07,14.32 28.1,16.38 | 28.99,22.23 30.04,21.18 C13.1 | IC3.79 15.6,30.46 | 15.6,30.46 18.22,27.84 v18.73,27.84 | v12.7,19.49 13.53,19.49 IC3.113 | IC3.39 27.59,28.45 28.86,29.72
  Top 0.406: 28.1,16.76 28.1,16.38
  Top 0.61: 23.97,16.51 23.97,16.03 24.57,15.44 | 25.75,14.35 25.09,15.01 | v27.24,17.62 28.1,16.76 | 28.86,29.72 29.87,29.72 C8.1
  Top 0.813: C12.1 24.68,15.44 24.57,15.44
  Bottom 0.254: 22.67,21.84 C11.1 | C10.1 25.66,19.14 25.69,19.14 | 27.21,17.62 v27.24,17.62 | C9.1 12.91,19.29 v12.7,19.49
  Bottom 0.61: v26.19,27.02 26.19,25.72 | 26.19,25.72 26.19,23.69 v24.35,21.84 | C10.1 24.35,20.45 v24.35,21.84 | v24.35,21.84 22.67,21.84 | 25.69,19.14 27.21,17.62 | v18.73,27.84 24.07,27.84 26.19,25.72
VDDC  (via drill 0.38)
  Top 0.254: IC3.87 12.27,29.26 13.34,28.19 | IC3.115 16.16,20.99
  Top 0.406: 16.16,20.99 v16.32,20.99
  Top 0.61: 13.34,28.19 15.94,25.59 v15.94,25.53
  Bottom 0.254: v16.32,20.99 16.41,21.08
  Bottom 0.406: 17.14,23.43 17.66,23.43 C17.1
  Bottom 0.61: C15.1 19.53,23.37 C17.1 17.72,21.21 C16.1 16.41,21.08 | v15.94,25.53 15.78,24.8 17.14,23.43
VIN  (via drill 0.6, 1.3, 1.4)
  Top 0.61: 31.11,14.81 U$2.2
  Top 1.016: R4.1 20.54,5.59 JP2.8
  Top 1.27: 31.11,14.81 31.11,14.38 | 31.11,14.38 31.11,14 31.15,13.97 v31.15,12.86 | D1.C 33.68,14.38 31.11,14.38
  Top 1.422: 61.77,37.48 62.17,37.08 C27.1 C6.1
  Top 1.676: 61.77,37.48 61.77,36.91 62.93,35.75 61.94,35.75 U2.3
  Top 2.54: 46.55,14.02 v46.55,8.76 | v61.72,37.53 61.77,37.48
  Bottom 1.27: JP2.8 20.57,6.29 28.29,14 31.18,14 | 31.18,14 44.1,14 46.55,11.56 v46.55,8.76 | v31.15,12.86 31.18,12.89 31.18,14
  Bottom 2.54: v46.55,8.76 47.75,7.56 63.74,7.56 | v61.72,37.53 61.72,35.24 65.09,31.88 65.25,22.92 65.25,22.87 arc45 65.32,22.69 65.32,9.13 63.74,7.56 | 63.74,7.56 arc45 63.92,7.63 | 63.74,7.56 63.79,7.56 arc45 63.97,7.63
WAKE_SIG
  Top 0.254: IC3.64 21.56,36.58 26.51,36.58 26.89,36.2 R8.2
WIFI_CLK
  Top 0.254: IC3.120 15.43,17.43 15.43,16.8 15.59,16.64 15.59,15.59 14.38,14.38 13.91,14.38 13.43,13.91
  Top 0.61: 13.43,13.91 13.43,13.21 5.3,5.08 JP2.2
WIFI_CS
  Top 0.254: IC3.121 16.45,17.91 15.84,17.3 15.84,17.08 16.07,16.64 16.13,15.49 14.83,14.13 14.83,13.49 14.13,12.79
  Top 0.61: 14.13,12.79 10.38,9.05 JP2.4
WIFI_DI  (via drill 0.38, 0.5)
  Top 0.254: IC3.123 17.04,17.36 17.84,18.13 18.57,18.13 19.49,17.24 v19.49,15.4 | 15.53,3.33 JP2.6
  Top 0.61: v15.53,10.19 15.53,3.33
  Bottom 0.61: 19.43,14.1 19.37,14.03 | 19.37,14.03 v15.53,10.19 | v19.49,15.4 19.37,15.27 19.37,14.03
WIFI_DO
  Top 0.254: IC3.124 17.33,17.04 16.57,16.29 16.61,15.65 16.61,15.34 15.46,14.03 15.46,13.34
  Top 0.61: 15.46,13.34 14.99,12.83 14.95,11.78 12.92,9.75 JP2.5
WIFI_EN  (via drill 0.38)
  Top 0.254: IC3.3 22,15.57 v22,15.05
  Bottom 0.61: v22,15.05 12.68,5.73 | JP2.1 2.79,2.92 2.79,4.6 3.68,5.49 5.3,5.49 5.33,5.46 12.41,5.46 12.61,5.65 12.68,5.73 | R14.2 12.68,5.73
WIFI_INT  (via drill 0.38)
  Top 0.254: IC3.126 17.08,15.69 17.11,15.27 16.89,15.05 16.86,14.61 v16.26,13.91
  Top 0.61: v8.35,6.41 7.84,5.91 JP2.3
  Bottom 0.61: v16.26,13.91 9.02,6.41 v8.35,6.41

### Text on the board
tPlace: RST | +3V3 | RFID_TRIG | TEST | GND | EECS 473 Body Cam | Version 1.1 / 11/18/2015 | Designed by: Jacob Perrin / Alec Ten Harmsel / Alex LaBerge / Yun Han / Jiqing Jiang